# Altium schematic sheet [10]-MAIN_POWER.SchDoc
size A4
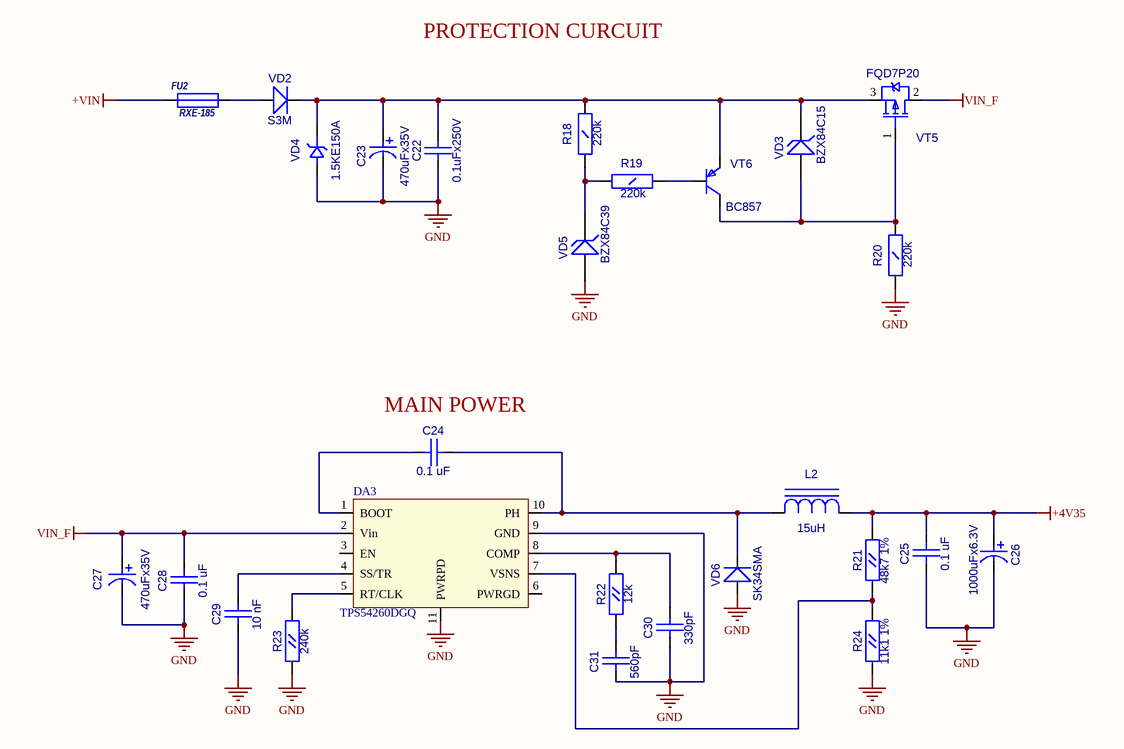
[diagram p0: [10]-MAIN_POWER.SchDoc]

## Parts
C22  0.1uFx250V  [CC1206]
C23  value 470uFx35V  [CC16X10_CAP0.5(1)(Primary)]  (hidden comment: CAP0.5(1))
C24  0.1 uF  [CC0603]
C25  0.1 uF  [CC0603]
C26  1000uFx6.3V  [CC8X3.5]
C27  470uFx35V  [CC16X10_CAP0.5(1)(Primary)]
C28  0.1 uF  [CC0603]
C29  10 nF  [CC0603]
C30  330pF  [CC0603]
C31  560pF  [CC0603]
DA3  TPS54260DGQ  [S-PDSO-G10]
FU2  RXE-185  [RXE-185]
L2  15uH  [SDR0805]
R18  220k  [RC1206]
R19  220k  [RC1206]
R20  220k  [RC1206]
R21  48k7 1%  [RC0603]
R22  12k  [RC0603]
R23  240k  [RC0603]
R24  11k1 1%  [RC0603]
VD2  S3M  [SMC]
VD3  BZX84C15  [SOT-23(123)]
VD4  1.5KE150A  [DO-201]
VD5  BZX84C39  [SOT-23(123)]
VD6  SK34SMA  [SMA]
VT5  FQD7P20  [D-PAK(TO-252AA)]
VT6  BC857  [SOT-23(123)]

## Nets
+4V35: C25.1(A) C26.1 L2.2(A) R21.2(B)
+VIN: FU2.1
GND: C22.1(A) C23.1 C25.2(B) C26.2 C27.1 C28.2(B) C29.2(B) C30.2(B) C31.2(B) DA3.9(GND) DA3.11(PWRPD) R20.1(A) R23.1(A) R24.1(A) VD4.1(A) VD5.1(A) VD6.1(A)
VIN_F: C27.2 C28.1(A) DA3.2(Vin) VT5.2(D)
NetC22_2: C22.2(B) C23.2 R18.2(B) VD2.2(K) VD3.3(K) VD4.2(K) VT5.3(S) VT6.2(E)
NetC24_1: C24.1(A) DA3.10(PH) L2.1(C) VD6.2(K)
NetC24_2: C24.2(B) DA3.1(BOOT)
NetC29_1: C29.1(A) DA3.4(SS/TR)
NetC30_1: C30.1(A) DA3.8(COMP) R22.2(B)
NetC31_1: C31.1(A) R22.1(A)
NetDA3_5: DA3.5(RT/CLK) R23.2(B)
NetDA3_7: DA3.7(VSNS) R21.1(A) R24.2(B)
NetFU2_2: FU2.2 VD2.1(A)
NetR18_1: R18.1(A) R19.1(A) VD5.3(K)
NetR19_2: R19.2(B) VT6.1(B)
NetR20_2: R20.2(B) VD3.1(A) VT5.1(G) VT6.3(C)

Not connected (* = marked no-connect by the designer): DA3 3(EN) 6(PWRGD)

## Notes on the sheet
- PROTECTION CURCUIT
- (near C24) MAIN POWER

## Library data of the parts
C22 = CC1206: Value: 0.1uFx250V
C24 C25 C28-C31 = CC0603
  C24 C25 C28: Value: 0.1 uF
  C29: Value: 10 nF
  C30: Value: 330pF
  C31: Value: 560pF
C26 = CAP0.35: Value: 1000uFx6.3V
C27 = CAP0.5(1): Value: 470uFx35V
L2 = SDR0805: Value: 15uH
R18-R20 = RC1206: Value: 220k
R21-R24 = RC0603
  R21: Value: 48k7 1%
  R22: Value: 12k
  R23: Value: 240k
  R24: Value: 11k1 1%
VD2 = S3A: Schottky Rectifier; Value: S3M
VD3 VD5 = BZX84: Zener Voltage Regulator Diode
  VD3: Value: BZX84C15
  VD5: Value: BZX84C39
VD4 = 1.5KE: Value: 1.5KE150A
VD6 = SK34SMA: Schottky Rectifier; Value: {Value}
VT5 = IRFR9220: HEXFET Power MOSFET; OriginalName: IRLML5103; ComponentField7: Published 8-Jun-2000; Value: FQD7P20
VT6 = BC857B: PNP 100ma transistor; OriginalName: BC846BLT1; ComponentField7: Published 29-Sep-2000; Value: BC857
FU2 = RXE-185: Value: *